# EAGLE design VIA_PAR_Adapter (EAGLE 9.5.2)
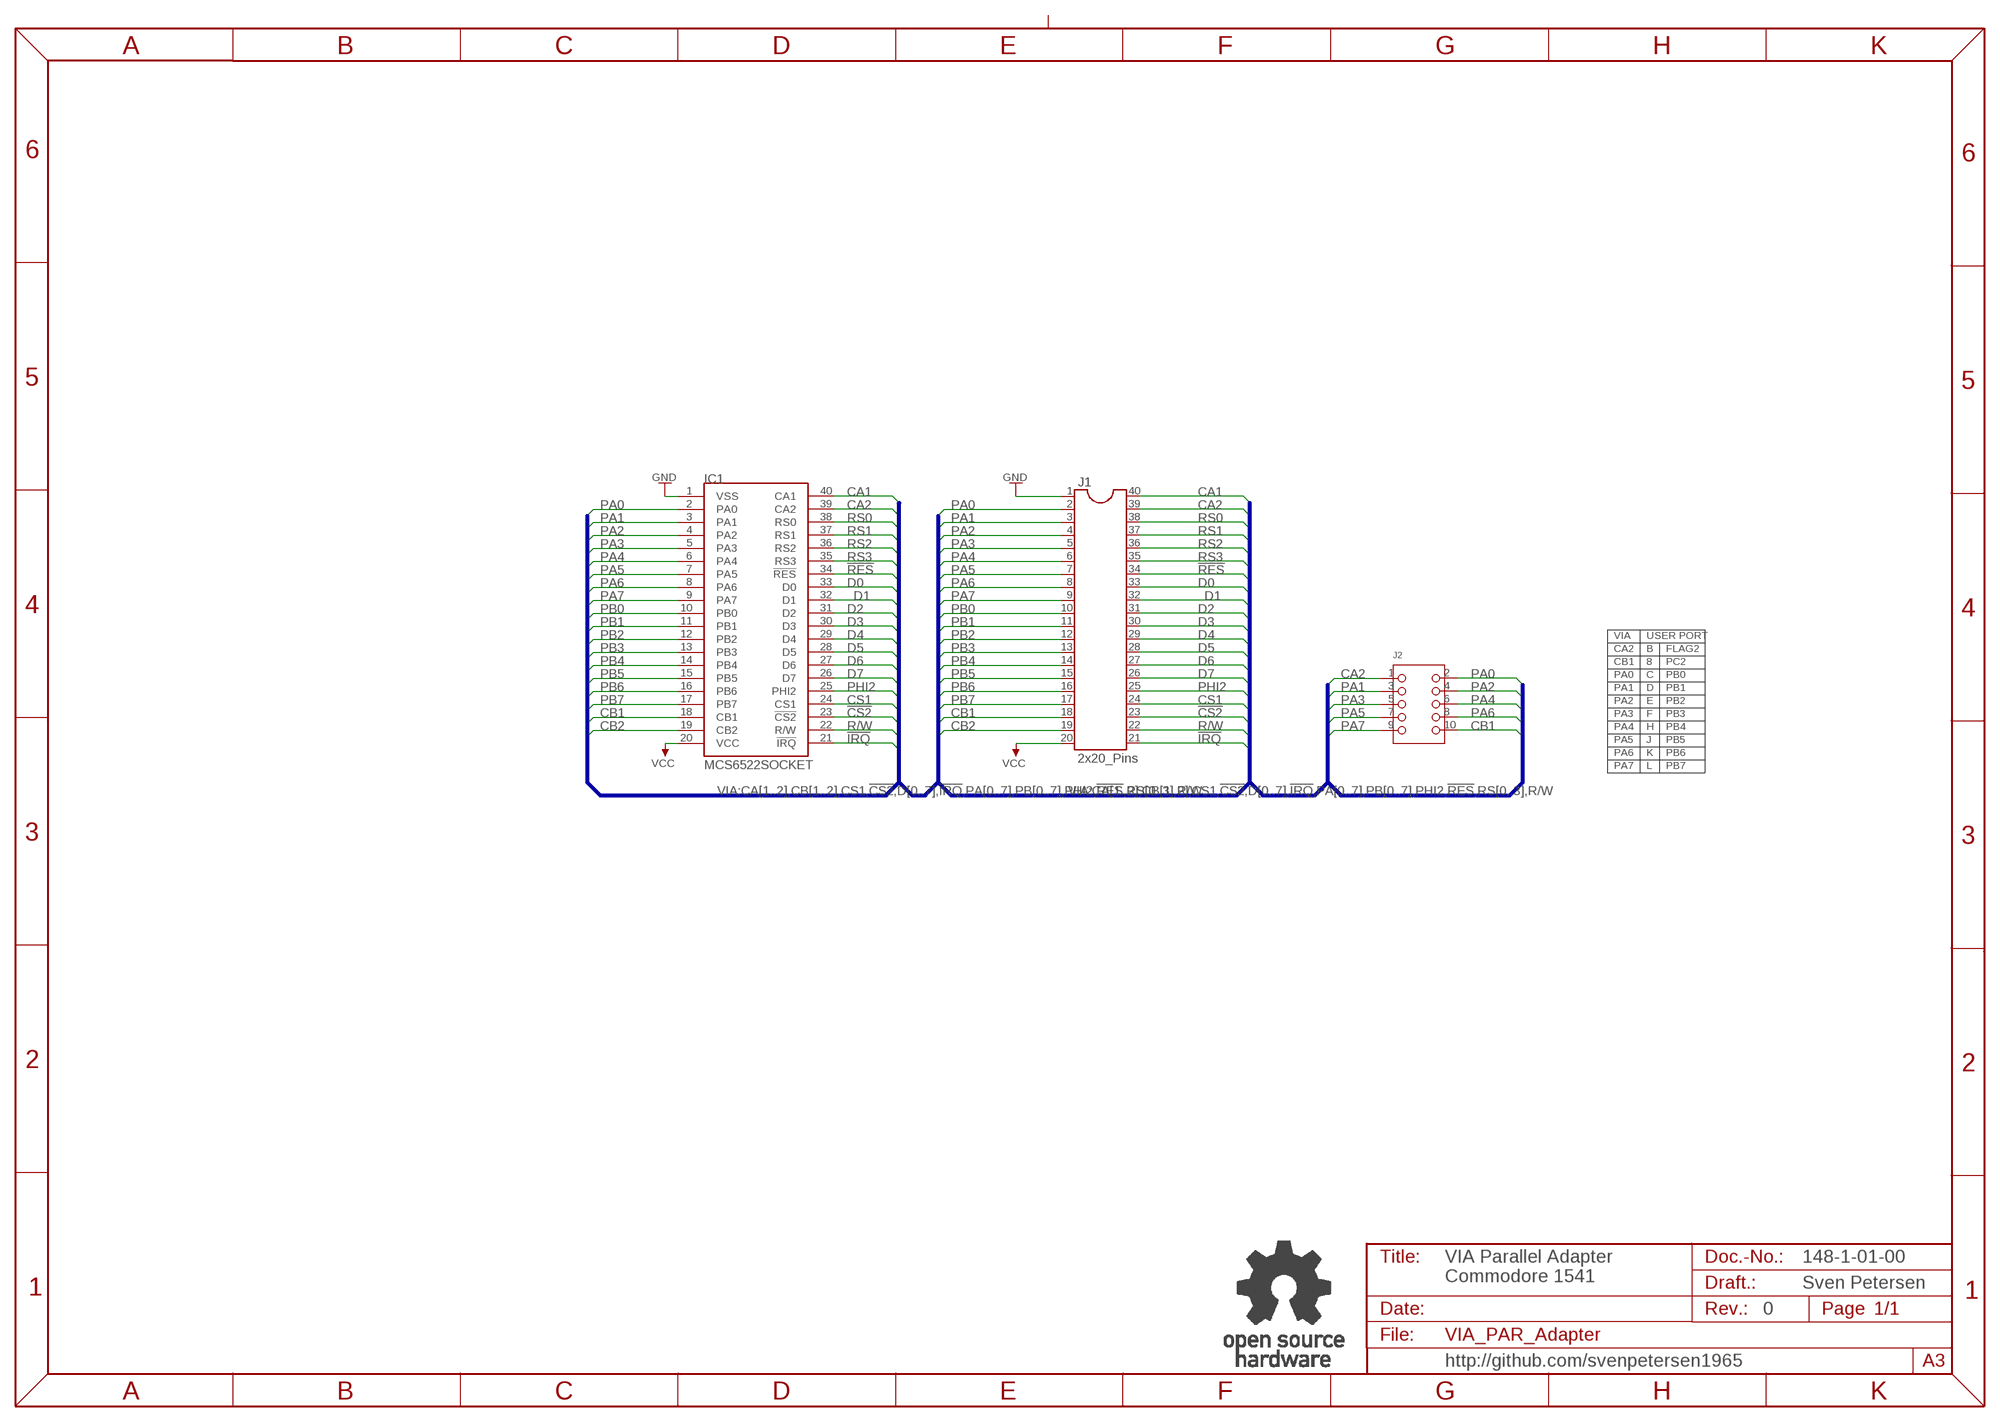
[diagram p0: schematic, sheet 1]

## Parts
IC1  MCS6522SOCKET  [GS40P]
J1  2x20_Pins  IC_DIL40  [DIL40_PINS_SS]
J2  2X05WV  [2X05WV]
U$10  OPEN_SOURCE_HW  [OPENHW]

## Nets
!CS2: IC1.23(!CS2) J1.23
!IRQ: IC1.21(!IRQ) J1.21
!RES: IC1.34(!RES) J1.34
CA1: IC1.40(CA1) J1.40
CA2: IC1.39(CA2) J1.39 J2.1
CB1: IC1.18(CB1) J1.18 J2.10
CB2: IC1.19(CB2) J1.19
CS1: IC1.24(CS1) J1.24
D0: IC1.33(D0) J1.33
D1: IC1.32(D1) J1.32
D2: IC1.31(D2) J1.31
D3: IC1.30(D3) J1.30
D4: IC1.29(D4) J1.29
D5: IC1.28(D5) J1.28
D6: IC1.27(D6) J1.27
D7: IC1.26(D7) J1.26
GND: IC1.1(VSS) J1.1
PA0: IC1.2(PA0) J1.2 J2.2
PA1: IC1.3(PA1) J1.3 J2.3
PA2: IC1.4(PA2) J1.4 J2.4
PA3: IC1.5(PA3) J1.5 J2.5
PA4: IC1.6(PA4) J1.6 J2.6
PA5: IC1.7(PA5) J1.7 J2.7
PA6: IC1.8(PA6) J1.8 J2.8
PA7: IC1.9(PA7) J1.9 J2.9
PB0: IC1.10(PB0) J1.10
PB1: IC1.11(PB1) J1.11
PB2: IC1.12(PB2) J1.12
PB3: IC1.13(PB3) J1.13
PB4: IC1.14(PB4) J1.14
PB5: IC1.15(PB5) J1.15
PB6: IC1.16(PB6) J1.16
PB7: IC1.17(PB7) J1.17
PHI2: IC1.25(PHI2) J1.25
R/W: IC1.22(R/W) J1.22
RS0: IC1.38(RS0) J1.38
RS1: IC1.37(RS1) J1.37
RS2: IC1.36(RS2) J1.36
RS3: IC1.35(RS3) J1.35
VCC: IC1.20(VCC) J1.20

## Buses
VIA:CA[1..2],CB[1..2],CS1,!CS2,D[0..7],!IRQ,PA[0..7],PB[0..7],PHI2,!RES,RS[0..3],R/W

## Notes on the sheet
- VIA | USER PORT
- CA2 | B | !FLAG2
- CB1 | 8 | !PC2
- PA0 | C | PB0
- PA1 | D | PB1
- PA2 | E | PB2
- PA3 | F | PB3
- PA4 | H | PB4
- PA5 | J | PB5
- PA6 | K | PB6
- PA7 | L | PB7
- 148-1-01-00
- VIA Parallel Adapter
  Commodore 1541
- Sven Petersen
- 0
- http://github.com/svenpetersen1965

## Library data of the parts
IC1 = MOS:MCS6522
J1 = MOS:IC_DIL40
J2 = PINHEAD:2X05WV
U$10 = Logo:OPEN_SOURCE_HW

## Board
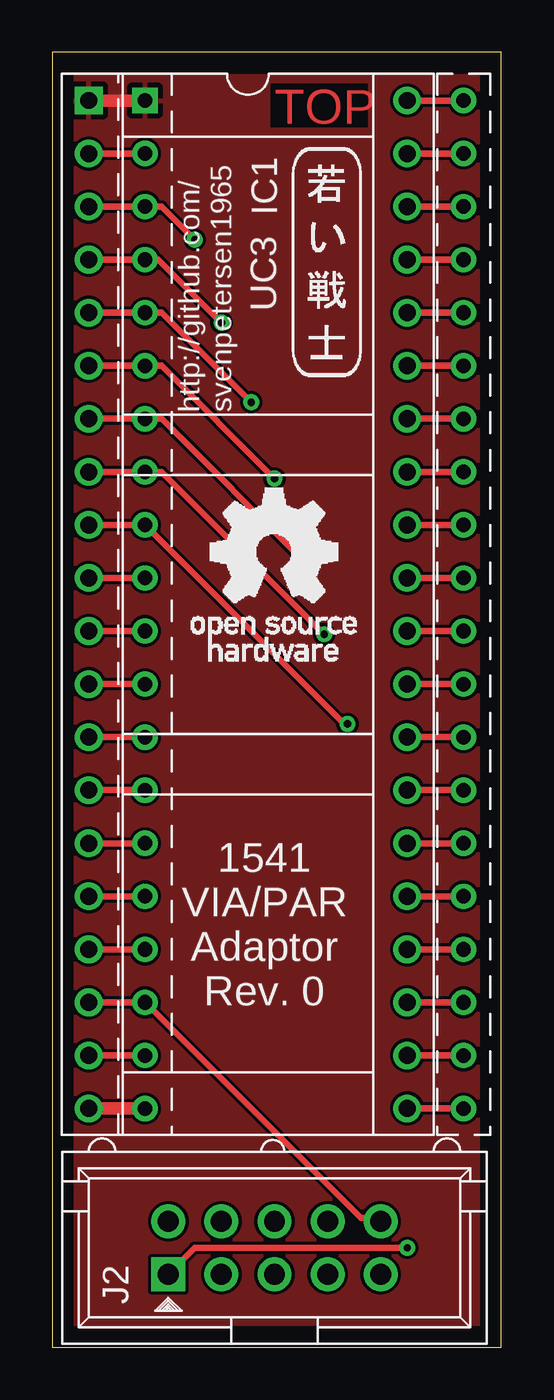
[diagram p1: board, top side]
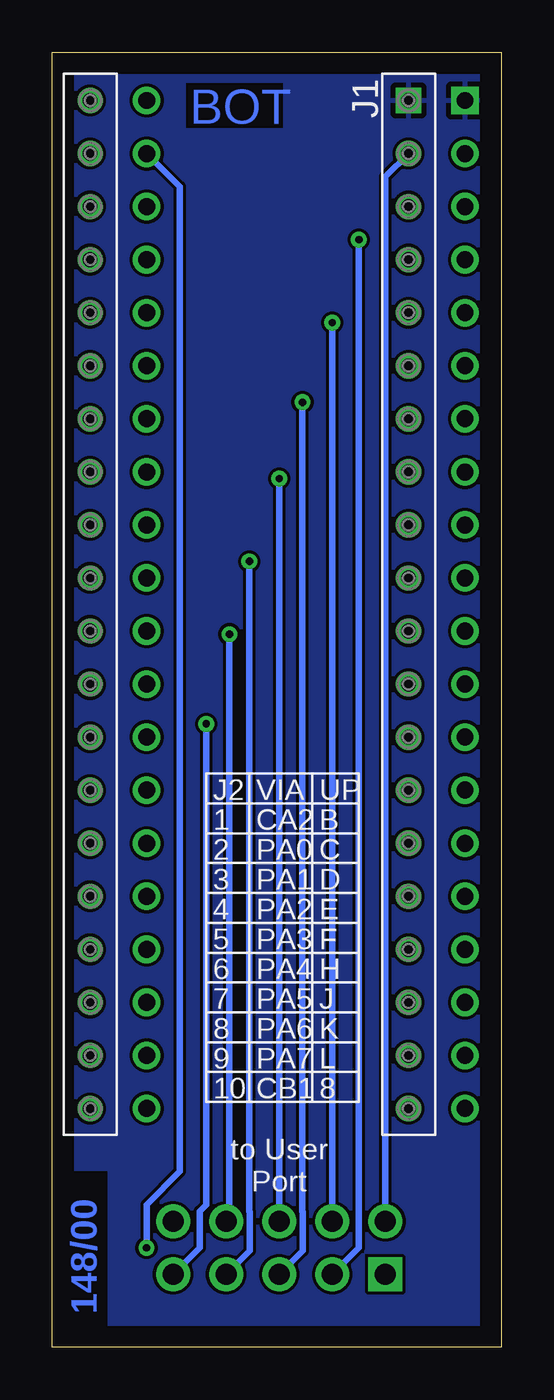
[diagram p2: board, bottom side, seen from below]

Size 21.5 x 62 mm. Coordinates in mm from the lower left corner, seen from the top.
Outline: 0,0 21.5,0 21.5,62 0,62 0,0
Copper layers (1*16): Top 0.035mm / dielectric 1.5mm / Bottom 0.035mm
Design rules "default *": minimum track width 6mil, minimum drill 0.35mm, track to track 6mil, track to pad 6mil, pad to pad 6mil, via to via 6mil, smd to smd 6mil, copper to edge 40mil, drill to drill 6mil, minimum pad ring 10mil, minimum via ring 8mil, stop-mask expansion 4mil, vias tented up to drill 25mil, thermal gap 10mil
bRestrict: 2 lines

### Footprints (pad centres in the part's own frame; a part is rotated, then mirrored left to right if it is on the bottom)
GS40P = drill 0.813 square: 1 -24.13,-7.62 | drill 0.813: 2 -21.59,-7.62; 3 -19.05,-7.62; 4 -16.51,-7.62; 5 -13.97,-7.62; 6 -11.43,-7.62; 7 -8.89,-7.62; 8 -6.35,-7.62; 9 -3.81,-7.62; 10 -1.27,-7.62; 11 1.27,-7.62; 12 3.81,-7.62; 13 6.35,-7.62; 14 8.89,-7.62; 15 11.43,-7.62; 16 13.97,-7.62; 17 16.51,-7.62; 18 19.05,-7.62; 19 21.59,-7.62; 20 24.13,-7.62; 21 24.13,7.62; 22 21.59,7.62; 23 19.05,7.62; 24 16.51,7.62; 25 13.97,7.62; 26 11.43,7.62; 27 8.89,7.62; 28 6.35,7.62; 29 3.81,7.62; 30 1.27,7.62; 31 -1.27,7.62; 32 -3.81,7.62; 33 -6.35,7.62; 34 -8.89,7.62; 35 -11.43,7.62; 36 -13.97,7.62; 37 -16.51,7.62; 38 -19.05,7.62; 39 -21.59,7.62; 40 -24.13,7.62
DIL40_PINS_SS = drill 0.7 square: 1 -24.13,-7.62 | drill 0.7: 2 -21.59,-7.62; 3 -19.05,-7.62; 4 -16.51,-7.62; 5 -13.97,-7.62; 6 -11.43,-7.62; 7 -8.89,-7.62; 8 -6.35,-7.62; 9 -3.81,-7.62; 10 -1.27,-7.62; 11 1.27,-7.62; 12 3.81,-7.62; 13 6.35,-7.62; 14 8.89,-7.62; 15 11.43,-7.62; 16 13.97,-7.62; 17 16.51,-7.62; 18 19.05,-7.62; 19 21.59,-7.62; 20 24.13,-7.62; 21 24.13,7.62; 22 21.59,7.62; 23 19.05,7.62; 24 16.51,7.62; 25 13.97,7.62; 26 11.43,7.62; 27 8.89,7.62; 28 6.35,7.62; 29 3.81,7.62; 30 1.27,7.62; 31 -1.27,7.62; 32 -3.81,7.62; 33 -6.35,7.62; 34 -8.89,7.62; 35 -11.43,7.62; 36 -13.97,7.62; 37 -16.51,7.62; 38 -19.05,7.62; 39 -21.59,7.62; 40 -24.13,7.62
2X05WV = drill 1 pad 1.626 square: 1 -5.08,-1.27 | drill 1 pad 1.626: 2 -5.08,1.27; 3 -2.54,-1.27; 4 -2.54,1.27; 5 0,-1.27; 6 0,1.27; 7 2.54,-1.27; 8 2.54,1.27; 9 5.08,-1.27; 10 5.08,1.27

### Placement (x,y rotation side)
IC1  9.37,35.56 270 top
J1  12.06,35.56 270 top
J2  10.64,4.76 0 top
U$6  [2LAYER]  10.64,58.58 0 top
U$7  [PCB-TITLE/]  0,68 0 top  (outside the outline)
U$8  [SVEN_TAG]  13.18,52.07 0 top
U$10  6.67,32.86 0 top

### Tracks (layer width: path | path; a pad name or v marks a point on that pad's centre or on a via)
!CS2
  Top 0.305: IC1.23 J1.23
!IRQ
  Top 0.305: IC1.21 J1.21
!RES
  Top 0.305: IC1.34 J1.34
CA1
  Top 0.305: IC1.40 J1.40
CA2  (via drill 0.35)
  Top 0.305: IC1.39 J1.39 | J2.1 6.83,4.76 v16.99,4.76
  Bottom 0.305: v16.99,4.76 16.99,6.83 15.4,8.41 15.4,55.56 IC1.39
CB1
  Top 0.305: IC1.18 J1.18 14.76,6.19 15.56,6.19 J2.10
CB2
  Top 0.305: IC1.19 J1.19
CS1
  Top 0.305: IC1.24 J1.24
D0
  Top 0.305: IC1.33 J1.33
D1
  Top 0.305: IC1.32 J1.32
D2
  Top 0.305: IC1.31 J1.31
D3
  Top 0.305: IC1.30 J1.30
D4
  Top 0.305: IC1.29 J1.29
D5
  Top 0.305: IC1.28 J1.28
D6
  Top 0.305: IC1.27 J1.27
D7
  Top 0.305: IC1.26 J1.26
GND
  Top 0.61: IC1.1 J1.1
  pour Top: 0.64,61.44 20.95,61.44 20.95,0.79 0.48,0.79 0.48,61.44
  pour Bottom: 0.48,61.44 20.95,61.44 20.95,0.79 0.48,0.79
PA0
  Top 0.305: IC1.2 J1.2
  Bottom 0.305: J2.2 5.56,56.04 J1.2
PA1  (via drill 0.35)
  Top 0.305: IC1.3 J1.3 5.24,54.61 v6.83,53.02
  Bottom 0.305: J2.3 6.83,4.76 v6.83,53.02
PA2  (via drill 0.35)
  Top 0.305: IC1.4 J1.4 5.08,52.07 v8.1,49.05
  Bottom 0.305: J2.4 v8.1,49.05
PA3  (via drill 0.35)
  Top 0.305: IC1.5 J1.5 5.24,49.53 v9.53,45.24
  Bottom 0.305: v9.53,45.24 9.53,6.5 9.52,6.5 9.52,4.61 J2.5
PA4  (via drill 0.35)
  Top 0.305: IC1.6 J1.6 5.24,46.99 v10.64,41.59
  Bottom 0.305: J2.6 v10.64,41.59
PA5  (via drill 0.35)
  Top 0.305: IC1.7 J1.7 5.24,44.45 v12.06,37.62
  Bottom 0.305: v12.06,37.62 12.06,6.5 12.06,4.61 J2.7
PA6  (via drill 0.35)
  Top 0.305: IC1.8 J1.8 5.24,41.91 v13.02,34.13
  Bottom 0.305: v13.02,34.13 13.02,6.19 J2.8
PA7  (via drill 0.35)
  Top 0.305: IC1.9 J1.9 14.05,29.77 v14.13,29.84
  Bottom 0.305: J2.9 14.45,4.76 14.45,6.51 14.13,6.83 v14.13,29.84
PB0
  Top 0.305: IC1.10 J1.10
PB1
  Top 0.305: IC1.11 J1.11
PB2
  Top 0.305: IC1.12 J1.12
PB3
  Top 0.305: IC1.13 J1.13
PB4
  Top 0.305: IC1.14 J1.14
PB5
  Top 0.305: IC1.15 J1.15
PB6
  Top 0.305: IC1.16 J1.16
PB7
  Top 0.305: IC1.17 J1.17
PHI2
  Top 0.305: IC1.25 J1.25
R/W
  Top 0.305: IC1.22 J1.22
RS0
  Top 0.305: IC1.38 J1.38
RS1
  Top 0.305: IC1.37 J1.37
RS2
  Top 0.305: IC1.36 J1.36
RS3
  Top 0.305: IC1.35 J1.35
VCC
  Top 0.61: IC1.20 J1.20

### Text on the board
Bottom: 148/00
tPlace: UC3 | http://github.com/ / svenpetersen1965 | 1541 / VIA/PAR / Adaptor / Rev. 0
bPlace: UP | VIA | J2 | B | CA2 | 1 | C | PA0 | 2 | D | PA1 | 3 | E | PA2 | 4 | F | PA3 | 5 | H | PA4 | 6 | J | PA5 | 7 | K | PA6 | 8 | L | PA7 | 9 | 8 | CB1 | 10 | to User / Port
Document: 148-2-01-00 | Sven Petersen / 2020 | 35µm | 2 | 0